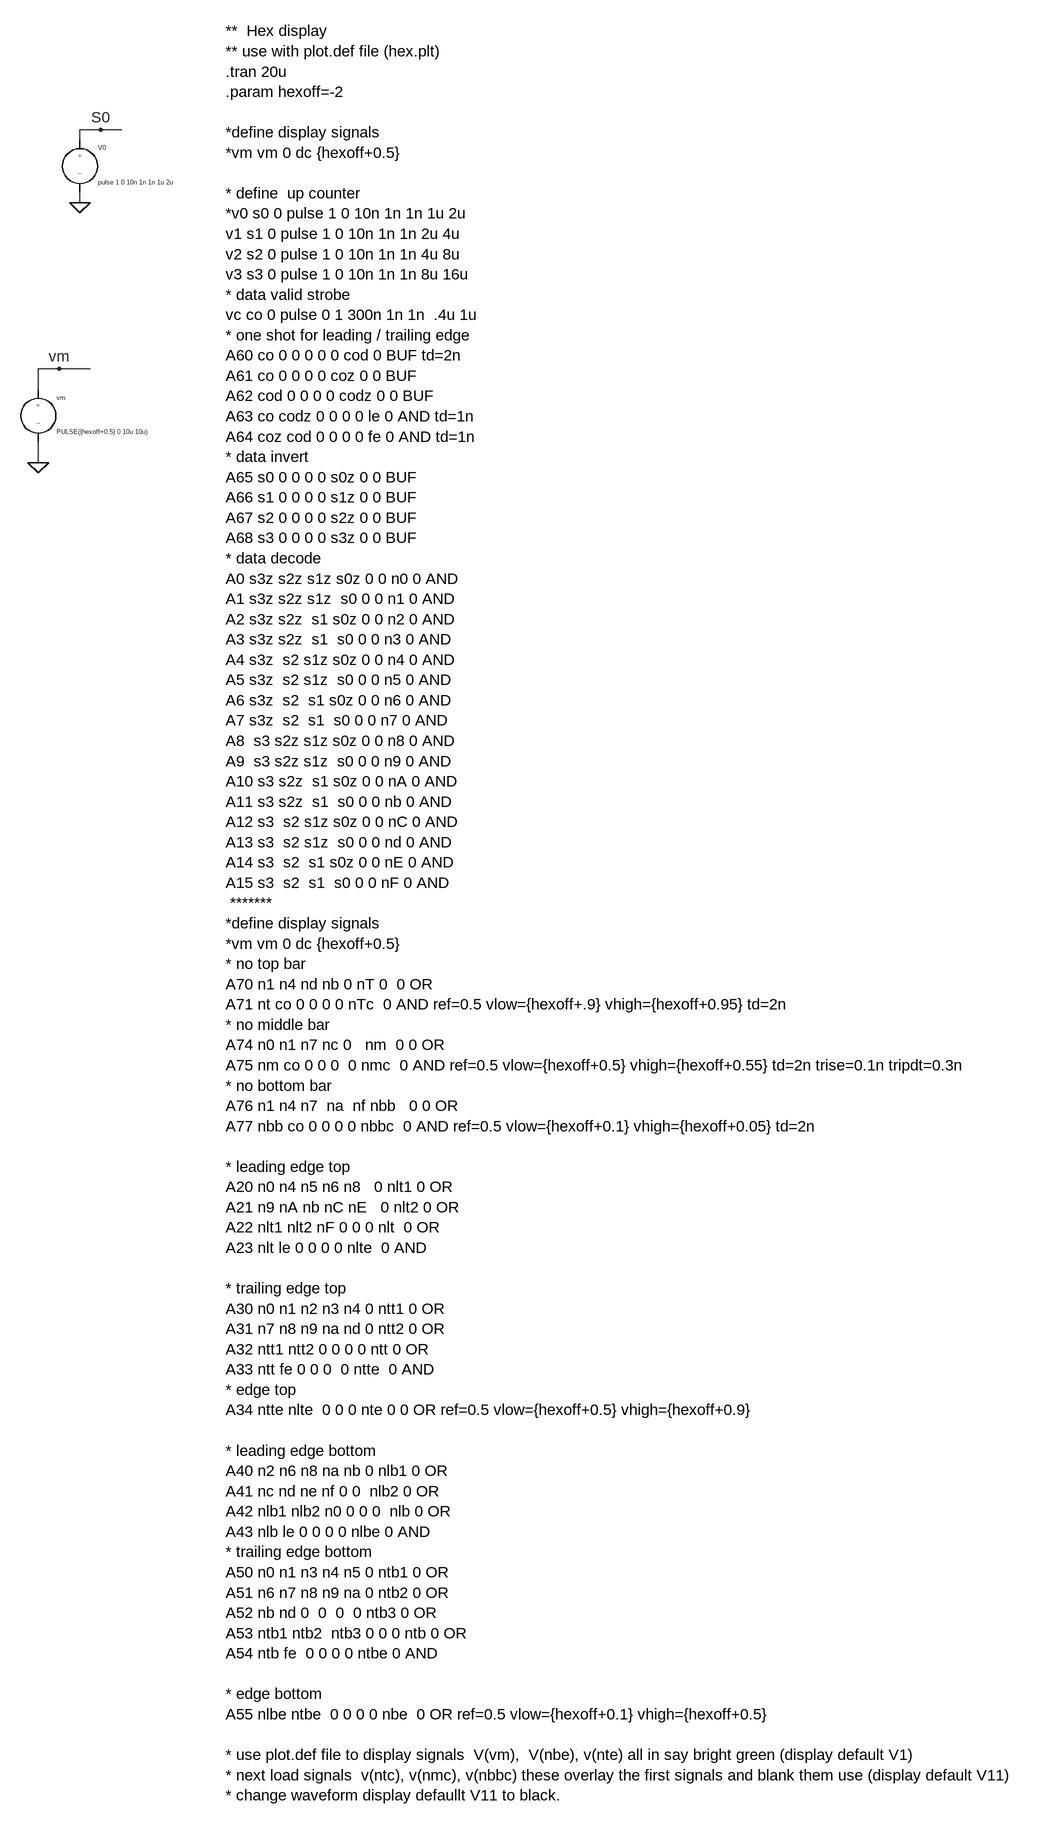
[diagram p0: schematic hexMDB.asc]
hexMDB.asc, the LTspice schematic file:
Version 4
SHEET 1 1452 2556
WIRE -208 256 -240 256
WIRE -176 256 -208 256
WIRE -240 272 -240 256
WIRE -240 368 -240 352
WIRE -272 624 -304 624
WIRE -224 624 -272 624
WIRE -304 656 -304 624
WIRE -304 768 -304 736
FLAG -240 368 0
FLAG -208 256 S0
FLAG -304 768 0
FLAG -272 624 vm
SYMBOL source-V -240 256 R0
SYMATTR InstName V0
SYMATTR Value pulse 1 0 10n 1n 1n 1u 2u
SYMBOL source-V -304 640 R0
WINDOW 123 0 0 Left 2
WINDOW 39 0 0 Left 2
SYMATTR InstName vm
SYMATTR Value PULSE({hexoff+0.5} 0 10u 10u)
TEXT -16 104 Left 2 !**  Hex display \n** use with plot.def file (hex.plt)\n.tran 20u\n.param hexoff=-2 \n \n*define display signals\n*vm vm 0 dc {hexoff+0.5}\n \n* define  up counter\n*v0 s0 0 pulse 1 0 10n 1n 1n 1u 2u\nv1 s1 0 pulse 1 0 10n 1n 1n 2u 4u\nv2 s2 0 pulse 1 0 10n 1n 1n 4u 8u\nv3 s3 0 pulse 1 0 10n 1n 1n 8u 16u\n* data valid strobe\nvc co 0 pulse 0 1 300n 1n 1n  .4u 1u\n* one shot for leading / trailing edge\nA60 co 0 0 0 0 0 cod 0 BUF td=2n\nA61 co 0 0 0 0 coz 0 0 BUF \nA62 cod 0 0 0 0 codz 0 0 BUF\nA63 co codz 0 0 0 0 le 0 AND td=1n\nA64 coz cod 0 0 0 0 fe 0 AND td=1n\n* data invert \nA65 s0 0 0 0 0 s0z 0 0 BUF \nA66 s1 0 0 0 0 s1z 0 0 BUF \nA67 s2 0 0 0 0 s2z 0 0 BUF \nA68 s3 0 0 0 0 s3z 0 0 BUF \n* data decode \nA0 s3z s2z s1z s0z 0 0 n0 0 AND\nA1 s3z s2z s1z  s0 0 0 n1 0 AND\nA2 s3z s2z  s1 s0z 0 0 n2 0 AND\nA3 s3z s2z  s1  s0 0 0 n3 0 AND\nA4 s3z  s2 s1z s0z 0 0 n4 0 AND\nA5 s3z  s2 s1z  s0 0 0 n5 0 AND\nA6 s3z  s2  s1 s0z 0 0 n6 0 AND\nA7 s3z  s2  s1  s0 0 0 n7 0 AND\nA8  s3 s2z s1z s0z 0 0 n8 0 AND\nA9  s3 s2z s1z  s0 0 0 n9 0 AND\nA10 s3 s2z  s1 s0z 0 0 nA 0 AND\nA11 s3 s2z  s1  s0 0 0 nb 0 AND\nA12 s3  s2 s1z s0z 0 0 nC 0 AND\nA13 s3  s2 s1z  s0 0 0 nd 0 AND\nA14 s3  s2  s1 s0z 0 0 nE 0 AND\nA15 s3  s2  s1  s0 0 0 nF 0 AND\n *******\n*define display signals\n*vm vm 0 dc {hexoff+0.5}\n* no top bar\nA70 n1 n4 nd nb 0 nT 0  0 OR \nA71 nt co 0 0 0 0 nTc  0 AND ref=0.5 vlow={hexoff+.9} vhigh={hexoff+0.95} td=2n\n* no middle bar\nA74 n0 n1 n7 nc 0   nm  0 0 OR \nA75 nm co 0 0 0  0 nmc  0 AND ref=0.5 vlow={hexoff+0.5} vhigh={hexoff+0.55} td=2n trise=0.1n tripdt=0.3n\n* no bottom bar\nA76 n1 n4 n7  na  nf nbb   0 0 OR\nA77 nbb co 0 0 0 0 nbbc  0 AND ref=0.5 vlow={hexoff+0.1} vhigh={hexoff+0.05} td=2n\n \n* leading edge top\nA20 n0 n4 n5 n6 n8   0 nlt1 0 OR\nA21 n9 nA nb nC nE   0 nlt2 0 OR\nA22 nlt1 nlt2 nF 0 0 0 nlt  0 OR\nA23 nlt le 0 0 0 0 nlte  0 AND \n \n* trailing edge top\nA30 n0 n1 n2 n3 n4 0 ntt1 0 OR\nA31 n7 n8 n9 na nd 0 ntt2 0 OR\nA32 ntt1 ntt2 0 0 0 0 ntt 0 OR\nA33 ntt fe 0 0 0  0 ntte  0 AND \n* edge top\nA34 ntte nlte  0 0 0 nte 0 0 OR ref=0.5 vlow={hexoff+0.5} vhigh={hexoff+0.9}\n \n* leading edge bottom\nA40 n2 n6 n8 na nb 0 nlb1 0 OR\nA41 nc nd ne nf 0 0  nlb2 0 OR\nA42 nlb1 nlb2 n0 0 0 0  nlb 0 OR\nA43 nlb le 0 0 0 0 nlbe 0 AND \n* trailing edge bottom\nA50 n0 n1 n3 n4 n5 0 ntb1 0 OR\nA51 n6 n7 n8 n9 na 0 ntb2 0 OR\nA52 nb nd 0  0  0  0 ntb3 0 OR\nA53 ntb1 ntb2  ntb3 0 0 0 ntb 0 OR \nA54 ntb fe  0 0 0 0 ntbe 0 AND\n \n* edge bottom\nA55 nlbe ntbe  0 0 0 0 nbe  0 OR ref=0.5 vlow={hexoff+0.1} vhigh={hexoff+0.5}\n \n* use plot.def file to display signals  V(vm),  V(nbe), v(nte) all in say bright green (display default V1)\n* next load signals  v(ntc), v(nmc), v(nbbc) these overlay the first signals and blank them use (display default V11)\n* change waveform display defaullt V11 to black.

The netlist it stands for:
* hexMDB.asc
V0 S0 0 pulse 1 0 10n 1n 1n 1u 2u
vm vm 0 PULSE({hexoff+0.5} 0 10u 10u)
**  Hex display
** use with plot.def file (hex.plt)
.tran 20u
.param hexoff=-2
*define display signals
*vm vm 0 dc {hexoff+0.5}
* define  up counter
*v0 s0 0 pulse 1 0 10n 1n 1n 1u 2u
v1 s1 0 pulse 1 0 10n 1n 1n 2u 4u
v2 s2 0 pulse 1 0 10n 1n 1n 4u 8u
v3 s3 0 pulse 1 0 10n 1n 1n 8u 16u
* data valid strobe
vc co 0 pulse 0 1 300n 1n 1n  .4u 1u
* one shot for leading / trailing edge
A60 co 0 0 0 0 0 cod 0 BUF td=2n
A61 co 0 0 0 0 coz 0 0 BUF
A62 cod 0 0 0 0 codz 0 0 BUF
A63 co codz 0 0 0 0 le 0 AND td=1n
A64 coz cod 0 0 0 0 fe 0 AND td=1n
* data invert
A65 s0 0 0 0 0 s0z 0 0 BUF
A66 s1 0 0 0 0 s1z 0 0 BUF
A67 s2 0 0 0 0 s2z 0 0 BUF
A68 s3 0 0 0 0 s3z 0 0 BUF
* data decode
A0 s3z s2z s1z s0z 0 0 n0 0 AND
A1 s3z s2z s1z  s0 0 0 n1 0 AND
A2 s3z s2z  s1 s0z 0 0 n2 0 AND
A3 s3z s2z  s1  s0 0 0 n3 0 AND
A4 s3z  s2 s1z s0z 0 0 n4 0 AND
A5 s3z  s2 s1z  s0 0 0 n5 0 AND
A6 s3z  s2  s1 s0z 0 0 n6 0 AND
A7 s3z  s2  s1  s0 0 0 n7 0 AND
A8  s3 s2z s1z s0z 0 0 n8 0 AND
A9  s3 s2z s1z  s0 0 0 n9 0 AND
A10 s3 s2z  s1 s0z 0 0 nA 0 AND
A11 s3 s2z  s1  s0 0 0 nb 0 AND
A12 s3  s2 s1z s0z 0 0 nC 0 AND
A13 s3  s2 s1z  s0 0 0 nd 0 AND
A14 s3  s2  s1 s0z 0 0 nE 0 AND
A15 s3  s2  s1  s0 0 0 nF 0 AND
 *******
*define display signals
*vm vm 0 dc {hexoff+0.5}
* no top bar
A70 n1 n4 nd nb 0 nT 0  0 OR
A71 nt co 0 0 0 0 nTc  0 AND ref=0.5 vlow={hexoff+.9} vhigh={hexoff+0.95} td=2n
* no middle bar
A74 n0 n1 n7 nc 0   nm  0 0 OR
A75 nm co 0 0 0  0 nmc  0 AND ref=0.5 vlow={hexoff+0.5} vhigh={hexoff+0.55} td=2n trise=0.1n tripdt=0.3n
* no bottom bar
A76 n1 n4 n7  na  nf nbb   0 0 OR
A77 nbb co 0 0 0 0 nbbc  0 AND ref=0.5 vlow={hexoff+0.1} vhigh={hexoff+0.05} td=2n
* leading edge top
A20 n0 n4 n5 n6 n8   0 nlt1 0 OR
A21 n9 nA nb nC nE   0 nlt2 0 OR
A22 nlt1 nlt2 nF 0 0 0 nlt  0 OR
A23 nlt le 0 0 0 0 nlte  0 AND
* trailing edge top
A30 n0 n1 n2 n3 n4 0 ntt1 0 OR
A31 n7 n8 n9 na nd 0 ntt2 0 OR
A32 ntt1 ntt2 0 0 0 0 ntt 0 OR
A33 ntt fe 0 0 0  0 ntte  0 AND
* edge top
A34 ntte nlte  0 0 0 nte 0 0 OR ref=0.5 vlow={hexoff+0.5} vhigh={hexoff+0.9}
* leading edge bottom
A40 n2 n6 n8 na nb 0 nlb1 0 OR
A41 nc nd ne nf 0 0  nlb2 0 OR
A42 nlb1 nlb2 n0 0 0 0  nlb 0 OR
A43 nlb le 0 0 0 0 nlbe 0 AND
* trailing edge bottom
A50 n0 n1 n3 n4 n5 0 ntb1 0 OR
A51 n6 n7 n8 n9 na 0 ntb2 0 OR
A52 nb nd 0  0  0  0 ntb3 0 OR
A53 ntb1 ntb2  ntb3 0 0 0 ntb 0 OR
A54 ntb fe  0 0 0 0 ntbe 0 AND
* edge bottom
A55 nlbe ntbe  0 0 0 0 nbe  0 OR ref=0.5 vlow={hexoff+0.1} vhigh={hexoff+0.5}
* use plot.def file to display signals  V(vm),  V(nbe), v(nte) all in say bright green (display default V1)
* next load signals  v(ntc), v(nmc), v(nbbc) these overlay the first signals and blank them use (display default V11)
* change waveform display defaullt V11 to black.
.backanno
.end